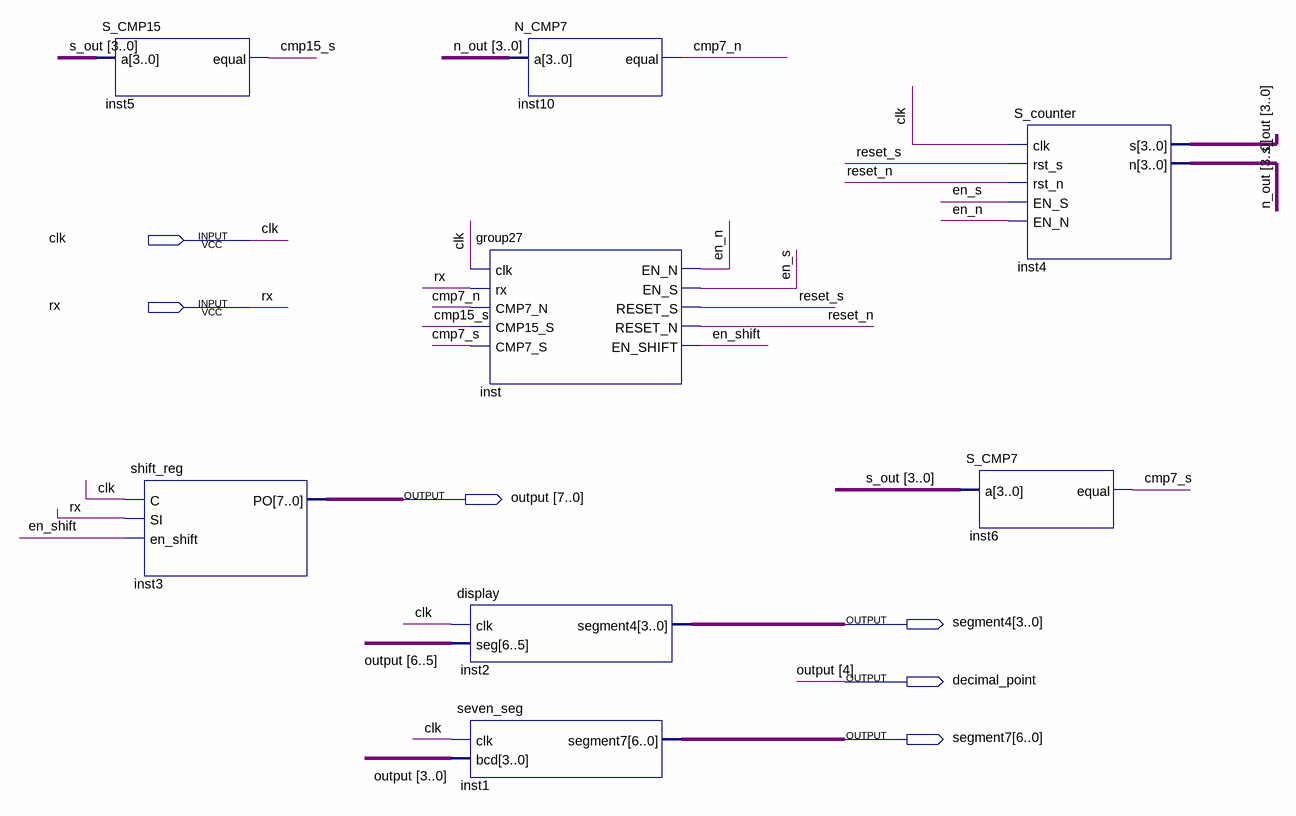
[diagram p0: schematic sheet]
// Quartus schematic a.bdf as structural Verilog: 8 symbols, 6 pins
module a (
  input  clk,
  input  rx,
  output [7:0] \output ,
  output [3:0] segment4,
  output decimal_point,
  output [6:0] segment7
);

  wire cmp7_n, cmp7_s, cmp15_s, en_n, en_s, en_shift, reset_n, reset_s;
  wire [3:0] n_out, s_out;

  S_CMP15 inst5 (.a(s_out), .equal(cmp15_s));
  shift_reg inst3 (.C(clk), .SI(rx), .en_shift(en_shift), .PO({\output [7:5], decimal_point, \output [3:0]}));
  group27 inst (
    .clk(clk), .rx(rx), .CMP7_N(cmp7_n), .CMP15_S(cmp15_s), .CMP7_S(cmp7_s), .EN_N(en_n), .EN_S(en_s),
    .RESET_S(reset_s), .RESET_N(reset_n), .EN_SHIFT(en_shift));
  display inst2 (.clk(clk), .seg(\output [6:5]), .segment4(segment4));
  seven_seg inst1 (.clk(clk), .bcd(\output [3:0]), .segment7(segment7));
  N_CMP7 inst10 (.a(n_out), .equal(cmp7_n));
  S_CMP7 inst6 (.a(s_out), .equal(cmp7_s));
  S_counter inst4 (.clk(clk), .rst_s(reset_s), .rst_n(reset_n), .EN_S(en_s), .EN_N(en_n), .s(s_out), .n(n_out));

  assign \output [4] = decimal_point;
endmodule
